# EAGLE design Power (EAGLE 9.6.2)
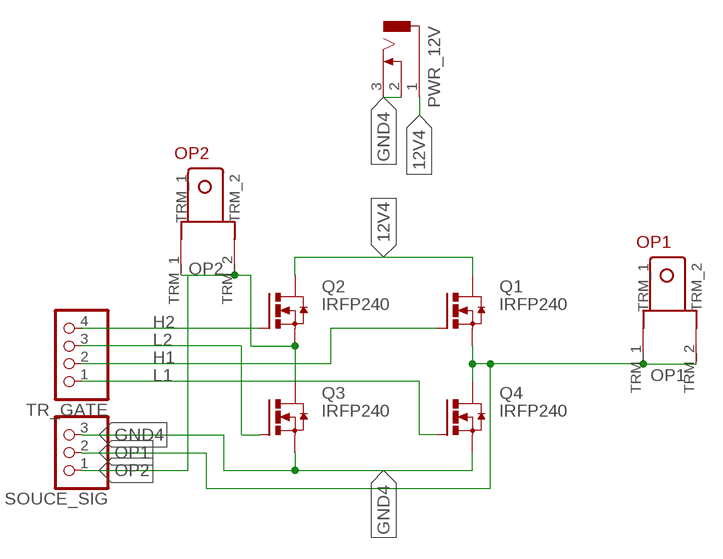
[diagram p0: schematic, sheet 1]

## Parts
OP1  TERMINAL_EDITED  [TERMINAL_EDITED]
OP2  TERMINAL_EDITED  [TERMINAL_EDITED]
PWR_12V  CON_JACK  [DCJ0303]
Q1  IRFP240  [TO247BV]
Q2  IRFP240  [TO247BV]
Q3  IRFP240  [TO247BV]
Q4  IRFP240  [TO247BV]
SOUCE_SIG  PINHD-1X3  [1X03]
TR_GATE  PINHD-1X4  [1X04]

## Nets
12V4: PWR_12V.1 Q1.D Q2.D
GND4: PWR_12V.2 PWR_12V.3 Q3.S Q4.S SOUCE_SIG.3
H1: Q1.G TR_GATE.2
H2: Q2.G TR_GATE.4
L1: Q4.G TR_GATE.1
L2: Q3.G TR_GATE.3
OP1: OP1.TRM_1 OP1.TRM_2 Q1.S Q4.D SOUCE_SIG.2
OP2: OP2.TRM_1 OP2.TRM_2 Q2.S Q3.D SOUCE_SIG.1

## Library data of the parts
OP1 OP2 = MIA_LIBRARY-2-2-2:TERMINAL_EDITED
PWR_12V = MIA_LIBRARY-2-2-2:CON_JACK: DC POWER JACK Source: DCJ0303.pdf; OC_FARNELL: unknown; OC_NEWARK: unknown
Q1-Q4 = MIA_LIBRARY-2-2-2:IRFP240: HEXFET Power MosFet Source: http://www.irf.com/
SOUCE_SIG = pinhead:PINHD-1X3: PIN HEADER
TR_GATE = pinhead:PINHD-1X4: PIN HEADER

## Board
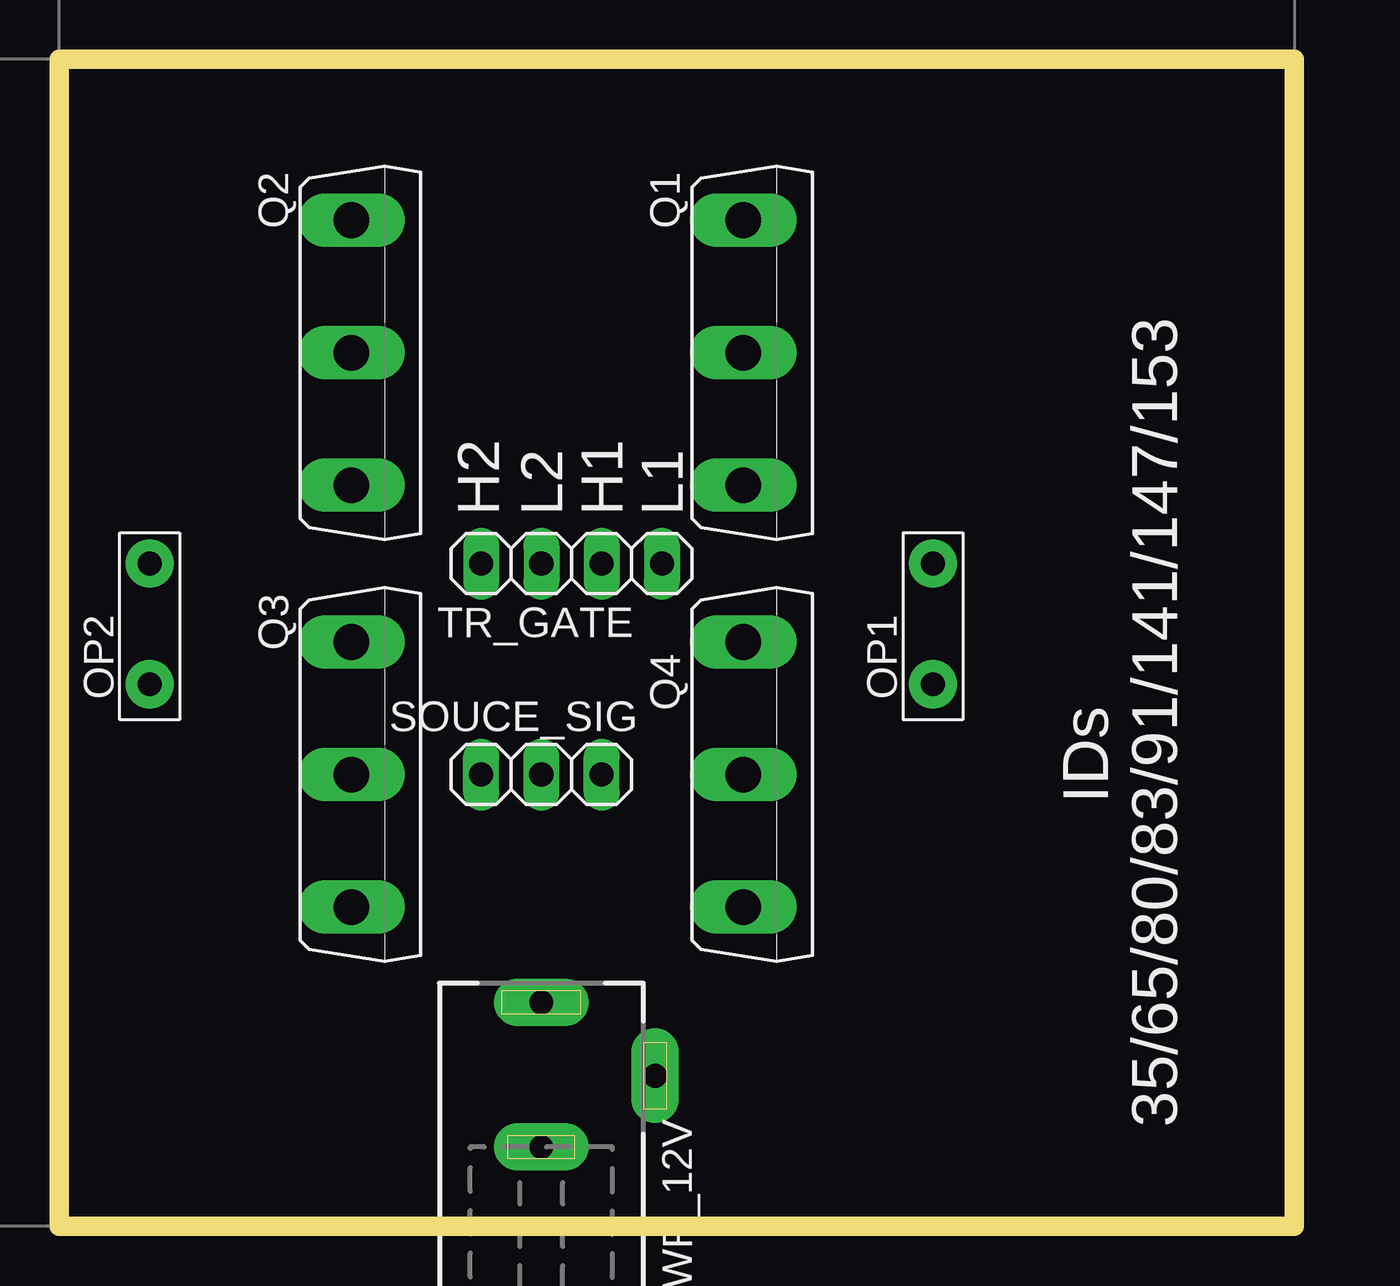
[diagram p1: board, top side]
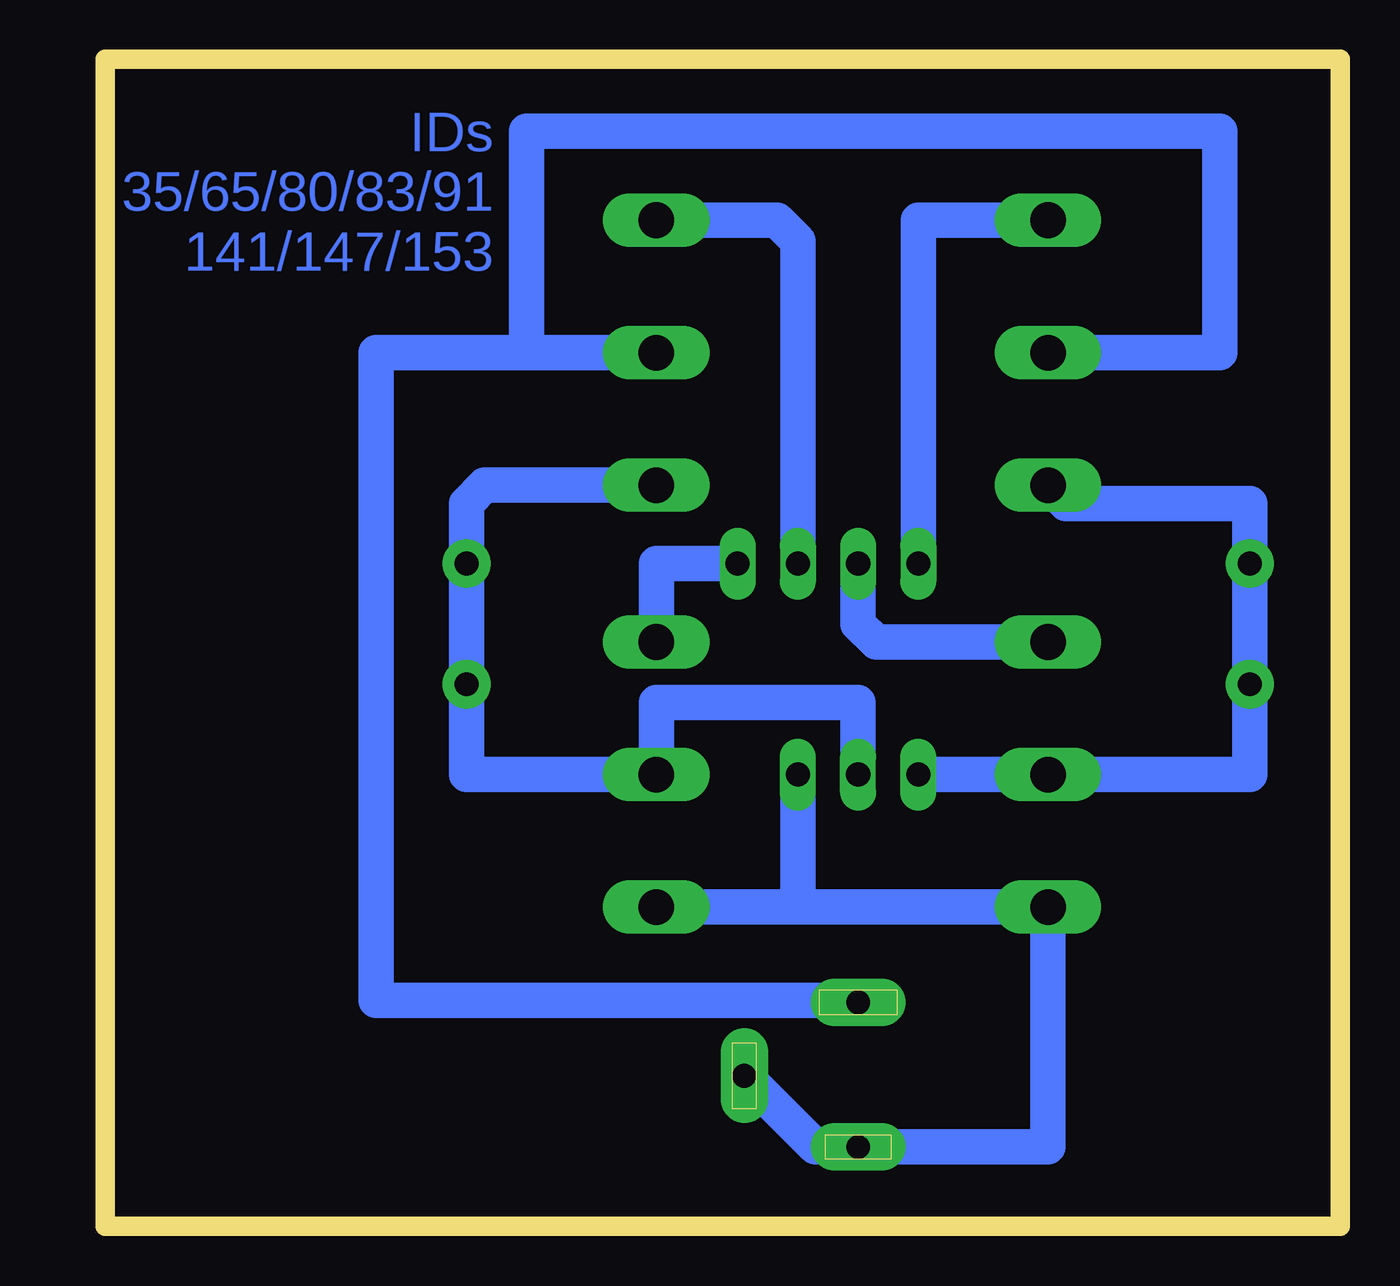
[diagram p2: board, bottom side, seen from below]

Size 52.05 x 49.2 mm. Coordinates in mm from the lower left corner, seen from the top.
Outline: 0,0 52.05,0 52.05,49.2 0,49.2 0,0
Copper layers (1*16): Top 0.035mm / dielectric 1.5mm / Bottom 0.035mm
Design rules "default": minimum track width 6mil, minimum drill 0.35mm, track to track 6mil, track to pad 6mil, pad to pad 6mil, via to via 6mil, smd to smd 6mil, copper to edge 40mil, drill to drill 6mil, minimum pad ring 10mil, minimum via ring 8mil, stop-mask expansion 4mil, vias tented up to drill 0mil, thermal gap 10mil

### Footprints (pad centres in the part's own frame; a part is rotated, then mirrored left to right if it is on the bottom)
TERMINAL_EDITED = drill 1 pad 2.032: TRM_1 -2.54,0; TRM_2 2.54,0
DCJ0303 = drill 1 pad 2 long: 1 0,3.1; 2 4.8,0; 3 0,-3
TO247BV = drill 1.499 long: D 0,-2.921; G -5.588,-2.921; S 5.588,-2.921
1X03 = drill 1.016 long: 1 -2.54,0; 2 0,0; 3 2.54,0
1X04 = drill 1.016 long: 1 -3.81,0; 2 -1.27,0; 3 1.27,0; 4 3.81,0

### Placement (x,y rotation side)
OP1  36.83,25.4 90 top
OP2  3.81,25.4 90 top
PWR_12V  20.32,6.35 0 top
Q1  31.75,36.83 270 top
Q2  15.24,36.83 270 top
Q3  15.24,19.05 270 top
Q4  31.75,19.05 270 top
SOUCE_SIG  20.32,19.05 0 top
TR_GATE  21.59,27.94 180 top

### Tracks (layer width: path | path; a pad name or v marks a point on that pad's centre or on a via)
12V4
  Bottom 1.5: PWR_12V.1 20.32,9.53 40.64,9.53 40.64,36.83 34.29,36.83 | 34.29,36.83 Q1.D | Q2.D 5.08,36.83 5.08,46.16 34.29,46.16 34.29,36.83
GND4
  Bottom 1.5: PWR_12V.2 22.12,3.35 PWR_12V.3 12.32,3.35 Q3.S 22.86,13.46 | 22.86,13.46 Q4.S | SOUCE_SIG.3 22.86,13.46
H1
  Bottom 1.5: TR_GATE.2 22.86,41.53 23.75,42.42 Q1.G
H2
  Bottom 1.5: TR_GATE.4 17.78,42.42 Q2.G
L1
  Bottom 1.5: TR_GATE.1 28.83,27.94 Q4.G
L2
  Bottom 1.5: Q3.G 19.56,24.64 20.32,25.4 TR_GATE.3
OP1
  Bottom 1.5: Q1.S 36.07,31.24 36.83,30.48 OP1.TRM_2 OP1.TRM_1 36.83,19.05 Q4.D 28.83,22.1 20.32,22.1 SOUCE_SIG.2
OP2
  Bottom 1.5: OP2.TRM_1 3.81,19.05 Q3.D 17.4,19.05 17.58,19.23 SOUCE_SIG.1 | OP2.TRM_1 OP2.TRM_2 3.81,30.48 11.56,30.48 Q2.S | OP2.TRM_1 3.68,22.73

### Text on the board
Bottom: IDs / 35/65/80/83/91 / 141/147/153
tPlace: H2 | L2 | H1 | L1 | IDs / 35/65/80/83/91/141/147/153
tDocu: GND3 | GND2 | GND | 12v | GND